# Altium schematic sheet Power_Block.SchDoc
size A4; SheetNumber: 2; SheetTotal: 8
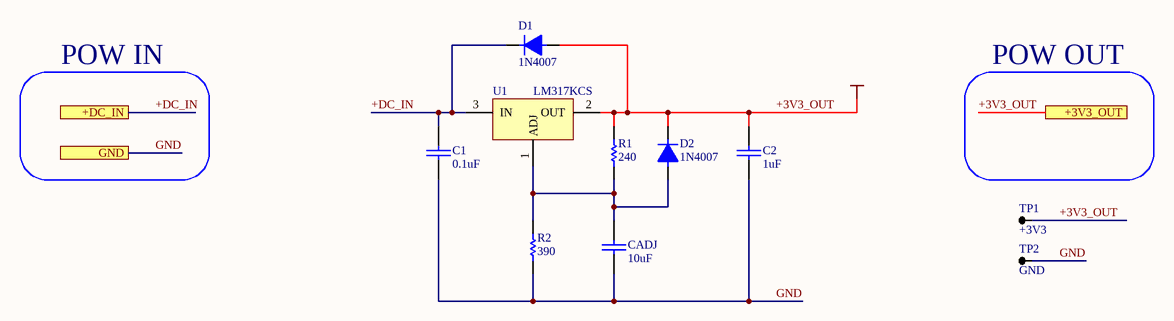
[diagram p0: Power_Block.SchDoc]

## Parts
C1  0.1uF  [0402-CAP-TDK]
C2  1uF  [0805-CAP-TDK]
CADJ  10uF  [0805-CAP-TDK]
D1  1N4007  [DO41]
D2  1N4007  [DO41]
R1  240  [0805-RES-PANASONIC]
R2  390  [0805-RES-PANASONIC]
TP1  +3V3  [534-5280]
TP2  GND  [534-5280]
U1  LM317KCS  [TO-220 - KCS0003B]

## Ports
+3V3_OUT, +DC_IN, GND

## Nets
+3V3_OUT: C2.2 D1.1 D2.2 R1.2 TP1.1 U1.2(OUT) ; port +3V3_OUT  [also labelled +3V3]
+DC_IN: C1.2 D1.2 U1.3(IN) ; port +DC_IN
GND: C1.1 C2.1 CADJ.1 R2.1 TP2.1 ; port GND
NetCADJ_2: CADJ.2 D2.1 R1.1 R2.2 U1.1(ADJ)

## Notes on the sheet
- POW IN
- POW OUT

## Library data of the parts
C1 C2 CADJ = CAP-SMD
  C1: JLCPart: C307331
  C2: JLCPart: C28323
  CADJ: JLCPart: C15850
D1 D2 = DIODE RECTIFIER
R1 R2 = RES-SMD
  R1: JLCPart: C17572
  R2: JLCPart: C17655
TP1 TP2 = TP-CLAW